# Altium schematic sheet Top_Level.SchDoc
size 420 x 297 mm; SheetNumber: 1; SheetTotal: 5
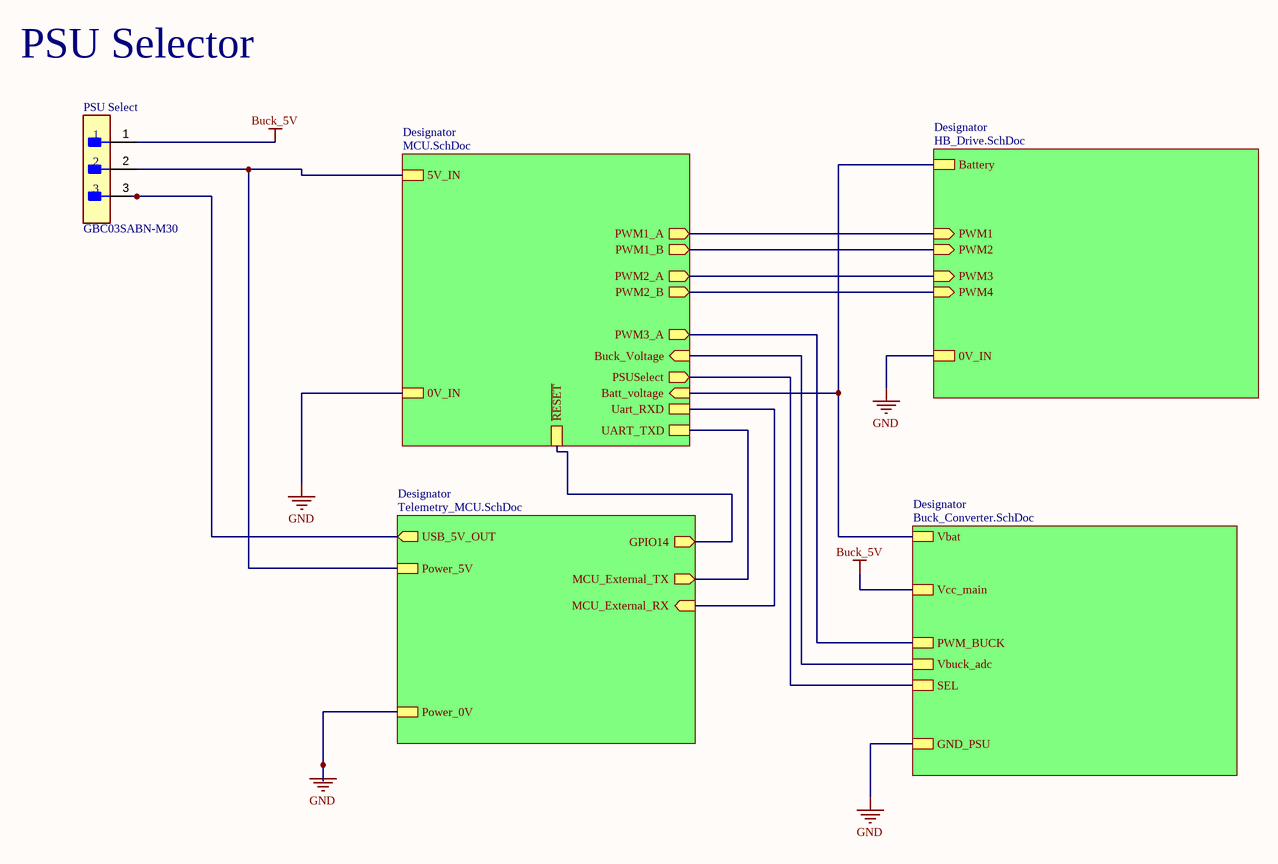
[diagram p0: Top_Level.SchDoc]

## Parts
PSU_Select  GBC03SABN-M30  [FP-GBC03SABN-M30-MFG]

## Sub-sheets
Designator = MCU.SchDoc: PWM1_B (out), 0V_IN, PWM1_A (out), PSUSelect (out), PWM3_A (out), UART_TXD, Uart_RXD, Buck_Voltage (in), 5V_IN, PWM2_A (out), PWM2_B (out), Batt_voltage (in), ~{RESET}
Designator = Telemetry_MCU.SchDoc: Power_5V, MCU_External_TX (out), Power_0V, MCU_External_RX (in), USB_5V_OUT (out), GPIO14 (out)
Designator = Buck_Converter.SchDoc: SEL, Vbat, PWM_BUCK, Vcc_main, GND_PSU, Vbuck_adc
Designator = HB_Drive.SchDoc: PWM3 (in), PWM2 (in), PWM1 (in), PWM4 (in), 0V_IN, Battery

## Nets
Buck_5V: PSU_Select.1 ; sheet Designator/Vcc_main
GND: sheet Designator/0V_IN, sheet Designator/Power_0V, sheet Designator/GND_PSU, sheet Designator/0V_IN
NetPSU_Select_2: PSU_Select.2 ; sheet Designator/5V_IN, sheet Designator/Power_5V
NetPSU_Select_3: PSU_Select.3 ; sheet Designator/USB_5V_OUT
(unnamed): sheet Designator/PWM1_B, sheet Designator/PWM2
(unnamed): sheet Designator/PWM1_A, sheet Designator/PWM1
(unnamed): sheet Designator/PSUSelect, sheet Designator/SEL
(unnamed): sheet Designator/PWM3_A, sheet Designator/PWM_BUCK
(unnamed): sheet Designator/UART_TXD, sheet Designator/MCU_External_TX
(unnamed): sheet Designator/Uart_RXD, sheet Designator/MCU_External_RX
(unnamed): sheet Designator/Buck_Voltage, sheet Designator/Vbuck_adc
(unnamed): sheet Designator/PWM2_A, sheet Designator/PWM3
(unnamed): sheet Designator/PWM2_B, sheet Designator/PWM4
(unnamed): sheet Designator/Batt_voltage, sheet Designator/Vbat, sheet Designator/Battery
(unnamed): sheet Designator/~{RESET}, sheet Designator/GPIO14

## Notes on the sheet
- PSU Selector
- THIS DOCUMENT AND THE DATA DISCLOSED HEREIN OR
- HEREWITH IS THE PROPERTY OF ALTIUM LIMITED AND MAY
- DWG NO:
- REVISION
- REV:
- DESCRIPTION
- DATE
- APPROVED
- BE FREELY DISTRIBUTED IN WHOLE. NO RIGHTS ARE
- RESERVED OR EXPRESS OR IMPLIED WARANTEE GIVEN.
- ENG:
- APPROVALS
- PROJECT
- DSN:
- CHK:
- REFERENCE DOCUMENTS
- PROJECT REVISION:
- TITLE
- DOCUMENT REVISION:
- DESIGN ITEM:
- BOM:
- FAB DWG:
- PCB DWG:
- ASSY DWG:
- SCALE:
- A3
- SIZE
- CAGE CODE
- FILE NAME
- DWG NO.
- SHEET
- OF
- REV

## Library data of the parts
PSU_Select = CMP-25680-000055-1: CONN HEADER SMD 3POS 2.54MM; Number of Positions: 3; Gender: Male; Connector Type: Male Pin; Pitch: 0.1inch; Contact Type: Male Pin; Contact Mating Length: 0.23inch; Termination: Solder; Housing Material: Plastic; Width: 2.54mm; Package Quantity: 1; Lead Free: Lead Free; Color: Black; Contact Plating: Gold; Housing Color: Black; Mount: Surface Mount; RoHS Compliant: Yes; Length: 7.62mm; Height: 2.54mm; Number of Contacts: 3; Contact Material: Bronze; Series: -; Number of Rows: 1; Packaging: Bulk